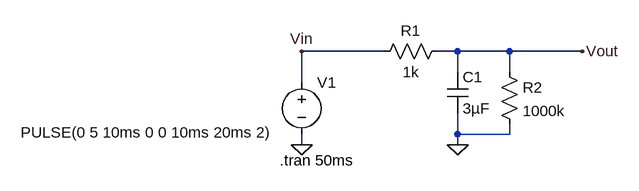
[diagram p0: schematic RC-Circuits-A1_1.asc]
RC-Circuits-A1_1.asc, the LTspice schematic file:
Version 4
SHEET 1 880 680
WIRE 144 80 16 80
WIRE 256 80 224 80
WIRE 336 80 256 80
WIRE 448 80 336 80
WIRE 256 112 256 80
WIRE 336 112 336 80
WIRE 16 128 16 80
WIRE 256 208 256 176
WIRE 336 208 336 192
WIRE 336 208 256 208
WIRE 16 224 16 208
WIRE 256 224 256 208
FLAG 16 224 0
FLAG 256 224 0
FLAG 448 80 Vout
FLAG 16 80 Vin
SYMBOL voltage 16 112 R0
WINDOW 3 -432 93 Left 2
WINDOW 123 0 0 Left 0
WINDOW 39 0 0 Left 0
SYMATTR InstName V1
SYMATTR Value PULSE(0 5 10ms 0 0 10ms 20ms 2)
SYMBOL res 240 64 R90
WINDOW 0 0 56 VBottom 2
WINDOW 3 32 56 VTop 2
SYMATTR InstName R1
SYMATTR Value 1k
SYMBOL cap 240 112 R0
SYMATTR InstName C1
SYMATTR Value 3µF
SYMBOL res 320 96 R0
SYMATTR InstName R2
SYMATTR Value 1000k
TEXT -18 248 Left 2 !.tran 50ms

The netlist it stands for:
* RC-Circuits-A1_1.asc
V1 Vin 0 PULSE(0 5 10ms 0 0 10ms 20ms 2)
R1 Vout Vin 1k
C1 Vout 0 3µF
R2 Vout 0 1000k
.tran 50ms
.backanno
.end